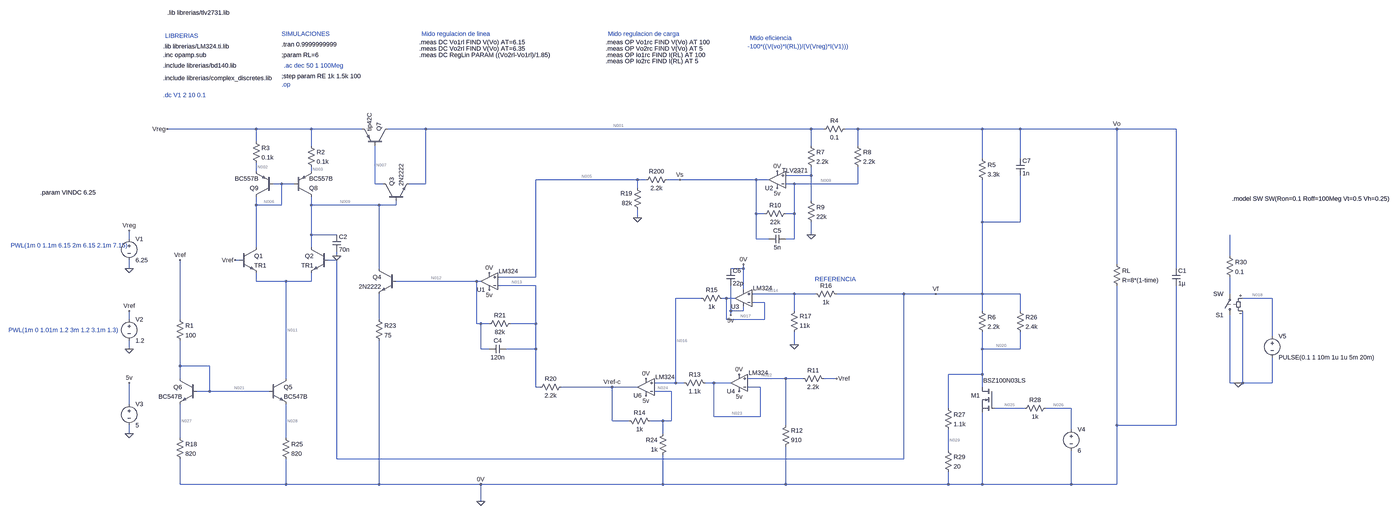
[diagram p0: schematic reguladorB_analisis_termico.asc, whole sheet]
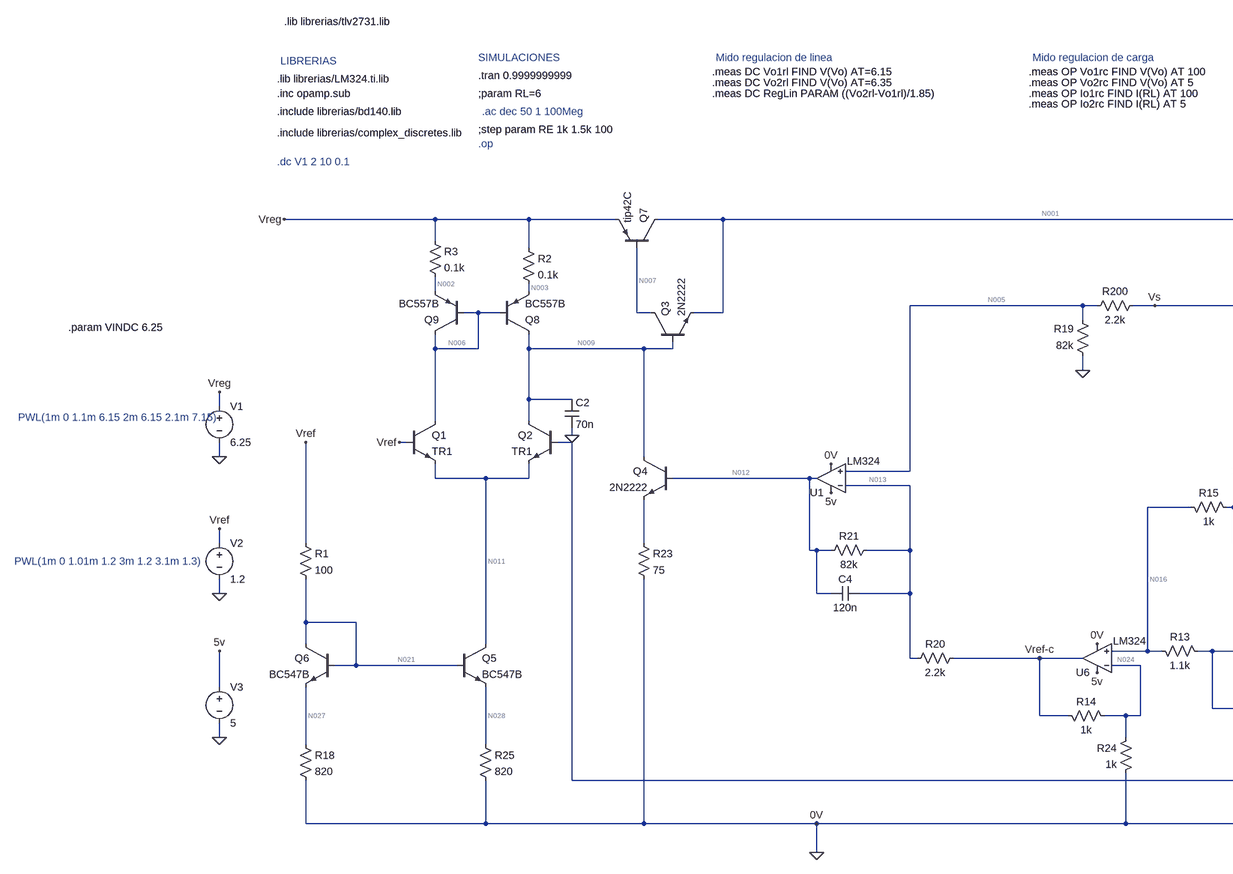
[diagram p1: schematic reguladorB_analisis_termico.asc, part, row 1 of 1, column 1 of 2]
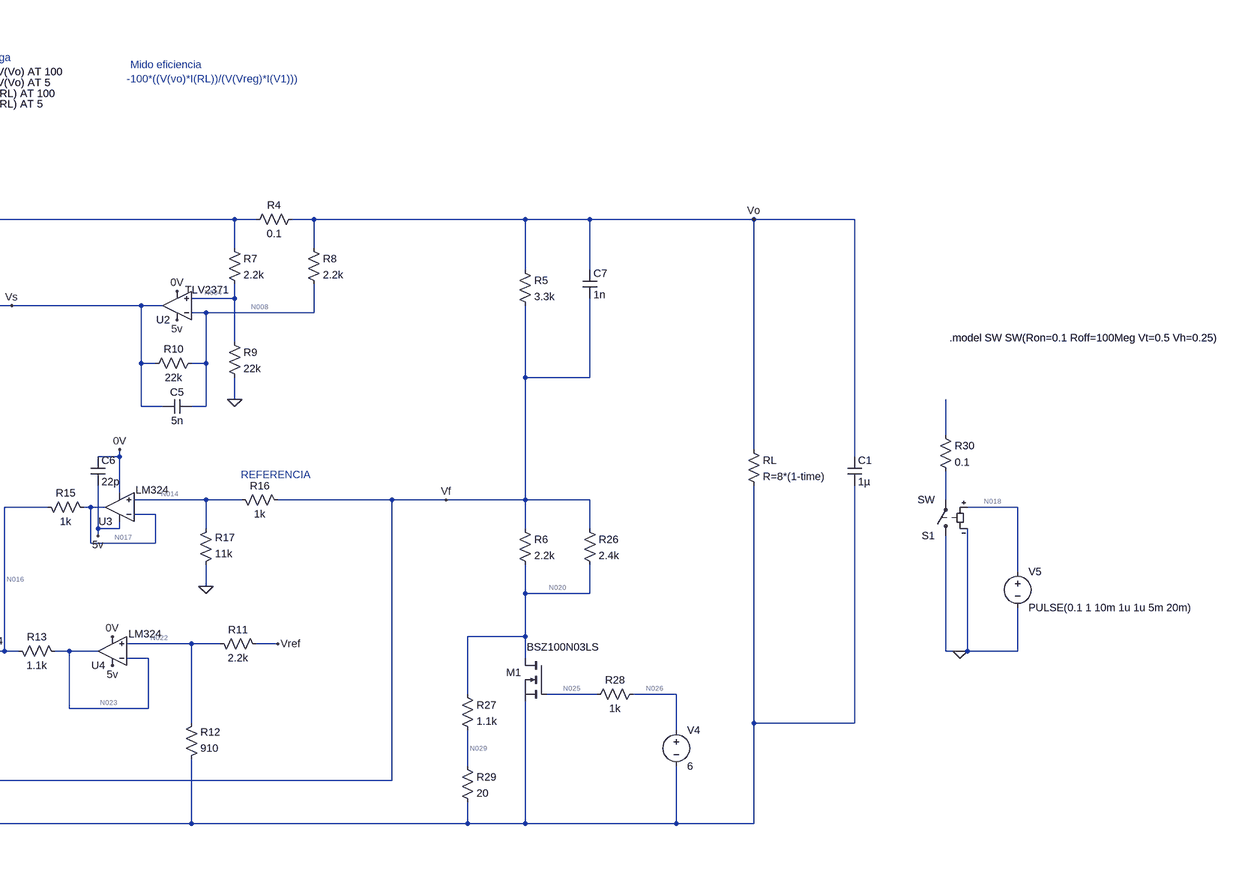
[diagram p2: schematic reguladorB_analisis_termico.asc, part, row 1 of 1, column 2 of 2]
reguladorB_analisis_termico.asc, the LTspice schematic file:
Version 4
SHEET 1 4852 1556
WIRE 128 -336 -208 -336
WIRE 336 -336 128 -336
WIRE 528 -336 336 -336
WIRE 768 -336 624 -336
WIRE 2224 -336 768 -336
WIRE 2272 -336 2224 -336
WIRE 2400 -336 2352 -336
WIRE 3040 -336 2400 -336
WIRE 3184 -336 3040 -336
WIRE 3632 -336 3184 -336
WIRE 3856 -336 3632 -336
WIRE 128 -288 128 -336
WIRE 336 -272 336 -336
WIRE 2224 -272 2224 -336
WIRE 2400 -272 2400 -336
WIRE 3040 -224 3040 -336
WIRE 3184 -224 3184 -336
WIRE 128 -176 128 -208
WIRE 336 -176 336 -192
WIRE 2224 -160 2224 -192
WIRE 2224 -160 2128 -160
WIRE 1568 -144 1184 -144
WIRE 1600 -144 1568 -144
WIRE 1728 -144 1680 -144
WIRE 2016 -144 1728 -144
WIRE 2064 -144 2016 -144
WIRE 224 -128 192 -128
WIRE 272 -128 224 -128
WIRE 576 -128 576 -272
WIRE 608 -128 576 -128
WIRE 768 -128 768 -336
WIRE 768 -128 704 -128
WIRE 2160 -128 2128 -128
WIRE 2400 -128 2400 -192
WIRE 2400 -128 2160 -128
WIRE 1568 -112 1568 -144
WIRE 2224 -64 2224 -160
WIRE 128 -48 128 -80
WIRE 224 -48 224 -128
WIRE 224 -48 128 -48
WIRE 336 -48 336 -80
WIRE 592 -48 336 -48
WIRE 656 -48 656 -64
WIRE 656 -48 592 -48
WIRE 2016 -16 2016 -144
WIRE 2048 -16 2016 -16
WIRE 2160 -16 2160 -128
WIRE 2160 -16 2128 -16
WIRE 1568 0 1568 -32
WIRE 3040 16 3040 -144
WIRE 3184 16 3184 -160
WIRE 3184 16 3040 16
WIRE 336 64 336 -48
WIRE 432 64 336 64
WIRE 2224 64 2224 16
WIRE -352 80 -352 48
WIRE 2016 80 2016 -16
WIRE 2064 80 2016 80
WIRE 2160 80 2160 -16
WIRE 2160 80 2128 80
WIRE 128 112 128 -48
WIRE 336 112 336 64
WIRE 432 144 432 128
WIRE 4192 144 4192 64
WIRE 64 160 48 160
WIRE 432 160 400 160
WIRE 3632 176 3632 -336
WIRE -352 192 -352 160
WIRE 592 192 592 -48
WIRE 1968 192 1968 176
WIRE 1968 192 1920 192
WIRE 3856 192 3856 -336
WIRE 1184 224 1184 -144
WIRE 1184 224 1040 224
WIRE 128 240 128 208
WIRE 240 240 128 240
WIRE 336 240 336 208
WIRE 336 240 240 240
WIRE 960 240 656 240
WIRE 976 240 960 240
WIRE 1184 256 1040 256
WIRE 1968 272 1968 192
WIRE 2160 288 2000 288
WIRE 2240 288 2160 288
WIRE 2640 288 2320 288
WIRE 2864 288 2640 288
WIRE 3040 288 3040 16
WIRE 3040 288 2864 288
WIRE 3184 288 3040 288
WIRE 4192 288 4192 224
WIRE 1808 304 1712 304
WIRE 1904 304 1888 304
WIRE 1936 304 1904 304
WIRE 4352 304 4240 304
WIRE 2048 320 2000 320
WIRE 1920 352 1920 256
WIRE 1968 352 1968 336
WIRE 1968 352 1920 352
WIRE 2160 352 2160 288
WIRE 3040 352 3040 288
WIRE 3184 352 3184 288
WIRE 1920 368 1920 352
WIRE -352 384 -352 352
WIRE -160 384 -160 160
WIRE 592 384 592 288
WIRE 1904 384 1904 304
WIRE 2048 384 2048 320
WIRE 2048 384 1904 384
WIRE 960 400 960 240
WIRE 976 400 960 400
WIRE 1008 400 976 400
WIRE 1184 400 1184 256
WIRE 1184 400 1088 400
WIRE 4352 448 4352 304
WIRE 2160 480 2160 432
WIRE -352 496 -352 464
WIRE 976 496 976 400
WIRE 1008 496 976 496
WIRE 1184 496 1184 400
WIRE 1184 496 1072 496
WIRE 3040 496 3040 432
WIRE 3184 496 3184 432
WIRE 3184 496 3040 496
WIRE -160 560 -160 464
WIRE -48 560 -160 560
WIRE 3040 592 3040 496
WIRE 3040 592 2912 592
WIRE -160 608 -160 560
WIRE 240 608 240 240
WIRE 2128 608 1984 608
WIRE 2192 608 2128 608
WIRE 2320 608 2272 608
WIRE 1712 624 1712 304
WIRE 1712 624 1632 624
WIRE 1744 624 1712 624
WIRE 1856 624 1824 624
WIRE 1920 624 1856 624
WIRE 4192 624 4192 368
WIRE 4224 624 4192 624
WIRE 4240 624 4240 352
WIRE 4240 624 4224 624
WIRE 4352 624 4352 528
WIRE 4352 624 4240 624
WIRE 1184 640 1184 496
WIRE 1200 640 1184 640
WIRE 1472 640 1280 640
WIRE 1568 640 1472 640
WIRE 2032 640 1984 640
WIRE 3040 640 3040 592
WIRE -48 656 -48 560
WIRE -48 656 -96 656
WIRE 176 656 -48 656
WIRE 1696 656 1632 656
WIRE -352 704 -352 624
WIRE 2912 720 2912 592
WIRE 3200 720 3088 720
WIRE 3376 720 3280 720
WIRE 1856 752 1856 624
WIRE 2032 752 2032 640
WIRE 2032 752 1856 752
WIRE 1472 768 1472 640
WIRE 1536 768 1472 768
WIRE 1664 768 1616 768
WIRE 1696 768 1696 656
WIRE 1696 768 1664 768
WIRE 2128 784 2128 608
WIRE 3632 784 3632 256
WIRE 3856 784 3856 256
WIRE 3856 784 3632 784
WIRE 3376 800 3376 720
WIRE -352 816 -352 784
WIRE 1664 816 1664 768
WIRE -160 832 -160 704
WIRE 240 832 240 704
WIRE 2912 880 2912 800
WIRE 432 912 432 160
WIRE 2640 912 2640 288
WIRE 2640 912 432 912
WIRE -160 1008 -160 912
WIRE 240 1008 240 912
WIRE 240 1008 -160 1008
WIRE 592 1008 592 464
WIRE 592 1008 240 1008
WIRE 976 1008 592 1008
WIRE 1664 1008 1664 896
WIRE 1664 1008 976 1008
WIRE 2128 1008 2128 864
WIRE 2128 1008 1664 1008
WIRE 2912 1008 2912 960
WIRE 2912 1008 2128 1008
WIRE 3040 1008 3040 736
WIRE 3040 1008 2912 1008
WIRE 3376 1008 3376 880
WIRE 3376 1008 3040 1008
WIRE 3632 1008 3632 784
WIRE 3632 1008 3376 1008
WIRE 976 1072 976 1008
FLAG 976 1072 0
FLAG -352 192 0
FLAG -352 496 0
FLAG -352 48 Vreg
FLAG -208 -336 Vreg
FLAG -352 352 Vref
FLAG 48 160 Vref
FLAG 1728 -144 Vs
FLAG 2160 480 0
FLAG 1472 640 Vref-c
FLAG 1568 0 0
FLAG 2320 608 Vref
FLAG 2864 288 Vf
FLAG 2224 64 0
FLAG 976 1008 0V
FLAG 2096 -176 0V
FLAG 1008 208 0V
FLAG 1968 176 0V
FLAG 1952 592 0V
FLAG 1600 608 0V
FLAG -352 816 0
FLAG -352 624 5v
FLAG 1920 368 5v
FLAG 2096 -112 5v
FLAG 1952 656 5v
FLAG 1600 672 5v
FLAG 1008 272 5v
FLAG 3632 -336 Vo
FLAG -160 160 Vref
FLAG 4224 624 0
FLAG 432 144 0
DATAFLAG 48 160 ""
DATAFLAG 336 -16 ""
DATAFLAG 128 32 ""
DATAFLAG 3536 -336 ""
DATAFLAG 2128 -336 ""
DATAFLAG 1936 -144 ""
DATAFLAG 1184 160 ""
DATAFLAG 1184 304 ""
DATAFLAG 912 240 ""
DATAFLAG 2544 288 ""
DATAFLAG 2128 688 ""
DATAFLAG 1872 624 ""
DATAFLAG 1360 640 ""
SYMBOL npn 64 112 R0
SYMATTR InstName Q1
SYMATTR Value TR1
SYMBOL npn 400 112 M0
SYMATTR InstName Q2
SYMATTR Value TR1
SYMBOL npn 608 -64 R270
SYMATTR InstName Q3
SYMATTR Value 2N2222
SYMBOL npn 176 608 R0
SYMATTR InstName Q5
SYMATTR Value BC547B
SYMBOL npn -96 608 M0
SYMATTR InstName Q6
SYMATTR Value BC547B
SYMBOL res -176 368 R0
SYMATTR InstName R1
SYMATTR Value 100
SYMBOL res 320 -288 R0
SYMATTR InstName R2
SYMATTR Value 0.1k
SYMBOL res 112 -304 R0
SYMATTR InstName R3
SYMATTR Value 0.1k
SYMBOL res 3616 160 R0
SYMATTR InstName RL
SYMATTR Value R=8*(1-time)
SYMBOL pnp 624 -272 M270
SYMATTR InstName Q7
SYMATTR Value tip42C
SYMBOL pnp 272 -80 M180
SYMATTR InstName Q8
SYMATTR Value BC557B
SYMBOL pnp 192 -80 R180
SYMATTR InstName Q9
SYMATTR Value BC557B
SYMBOL voltage -352 64 R0
WINDOW 123 0 0 Left 0
WINDOW 39 0 0 Left 0
SYMATTR InstName V1
SYMATTR Value 6.25
SYMBOL voltage -352 368 R0
WINDOW 123 0 0 Left 0
WINDOW 39 0 0 Left 0
SYMATTR InstName V2
SYMATTR Value 1.2
SYMBOL res 2208 -288 R0
SYMATTR InstName R7
SYMATTR Value 2.2k
SYMBOL res 2384 -288 R0
SYMATTR InstName R8
SYMATTR Value 2.2k
SYMBOL res 2208 -80 R0
SYMATTR InstName R9
SYMATTR Value 22k
SYMBOL res 2144 -32 R90
WINDOW 0 0 56 VBottom 2
WINDOW 3 32 56 VTop 2
SYMATTR InstName R10
SYMATTR Value 22k
SYMBOL res 2176 592 M90
WINDOW 0 0 56 VBottom 2
WINDOW 3 32 56 VTop 2
SYMATTR InstName R11
SYMATTR Value 2.2k
SYMBOL res 2112 880 M180
WINDOW 0 36 76 Left 2
WINDOW 3 36 40 Left 2
SYMATTR InstName R12
SYMATTR Value 910
SYMBOL res 1728 608 M90
WINDOW 0 0 56 VBottom 2
WINDOW 3 32 56 VTop 2
SYMATTR InstName R13
SYMATTR Value 1.1k
SYMBOL res 1520 752 M90
WINDOW 0 0 56 VBottom 2
WINDOW 3 32 56 VTop 2
SYMATTR InstName R14
SYMATTR Value 1k
SYMBOL res 1792 288 M90
WINDOW 0 0 56 VBottom 2
WINDOW 3 32 56 VTop 2
SYMATTR InstName R15
SYMATTR Value 1k
SYMBOL res 2224 272 M90
WINDOW 0 0 56 VBottom 2
WINDOW 3 32 56 VTop 2
SYMATTR InstName R16
SYMATTR Value 1k
SYMBOL res 2144 448 M180
WINDOW 0 36 76 Left 2
WINDOW 3 36 40 Left 2
SYMATTR InstName R17
SYMATTR Value 11k
SYMBOL res 1184 656 R270
WINDOW 0 32 56 VTop 2
WINDOW 3 0 56 VBottom 2
SYMATTR InstName R20
SYMATTR Value 2.2k
SYMBOL res 576 368 R0
SYMATTR InstName R23
SYMATTR Value 75
SYMBOL res 1680 800 M0
SYMATTR InstName R24
SYMATTR Value 1k
SYMBOL res 992 416 R270
WINDOW 0 32 56 VTop 2
WINDOW 3 0 56 VBottom 2
SYMATTR InstName R21
SYMATTR Value 82k
SYMBOL res 1696 -160 R90
WINDOW 0 0 56 VBottom 2
WINDOW 3 32 56 VTop 2
SYMATTR InstName R200
SYMATTR Value 2.2k
SYMBOL res 1584 -16 R180
WINDOW 0 36 76 Left 2
WINDOW 3 36 40 Left 2
SYMATTR InstName R19
SYMATTR Value 82k
SYMBOL res 2256 -320 R270
WINDOW 0 32 56 VTop 2
WINDOW 3 0 56 VBottom 2
SYMATTR InstName R4
SYMATTR Value 0.1
SYMBOL npn 656 192 M0
SYMATTR InstName Q4
SYMATTR Value 2N2222
SYMBOL OpAmps\\opamp2 1600 704 R180
WINDOW 3 -110 102 Left 2
SYMATTR Value LM324
SYMATTR InstName U6
SYMBOL OpAmps\\opamp2 2096 -80 R180
WINDOW 3 -116 99 Left 2
SYMATTR Value TLV2371
SYMATTR InstName U2
SYMBOL OpAmps\\opamp2 1008 304 R180
WINDOW 3 -110 102 Left 2
SYMATTR Value LM324
SYMATTR InstName U1
SYMBOL OpAmps\\opamp2 1968 368 R180
WINDOW 3 -110 102 Left 2
SYMATTR Value LM324
SYMATTR InstName U3
SYMBOL OpAmps\\opamp2 1952 688 R180
WINDOW 3 -110 102 Left 2
SYMATTR Value LM324
SYMATTR InstName U4
SYMBOL voltage -352 688 R0
WINDOW 123 0 0 Left 0
WINDOW 39 0 0 Left 0
SYMATTR InstName V3
SYMATTR Value 5
SYMBOL res 3024 -240 R0
SYMATTR InstName R5
SYMATTR Value 3.3k
SYMBOL res 3024 336 R0
SYMATTR InstName R6
SYMATTR Value 2.2k
SYMBOL res 3168 336 R0
SYMATTR InstName R26
SYMATTR Value 2.4k
SYMBOL nmos 3088 640 M0
WINDOW 3 -116 -25 Left 2
SYMATTR Value BSZ100N03LS
SYMATTR InstName M1
SYMBOL res 3296 704 R90
WINDOW 0 0 56 VBottom 2
WINDOW 3 32 56 VTop 2
SYMATTR InstName R28
SYMATTR Value 1k
SYMBOL voltage 3376 784 R0
WINDOW 123 0 0 Left 0
WINDOW 39 0 0 Left 0
SYMATTR InstName V4
SYMATTR Value 6
SYMBOL res 2896 704 R0
SYMATTR InstName R27
SYMATTR Value 1.1k
SYMBOL res 2896 864 R0
SYMATTR InstName R29
SYMATTR Value 20
SYMBOL res -176 816 R0
SYMATTR InstName R18
SYMATTR Value 820
SYMBOL res 224 816 R0
SYMATTR InstName R25
SYMATTR Value 820
SYMBOL voltage 4352 432 R0
WINDOW 123 0 0 Left 0
WINDOW 39 0 0 Left 0
SYMATTR InstName V5
SYMATTR Value PULSE(0.1 1 10m 1u 1u 5m 20m)
SYMBOL sw 4192 384 R180
SYMATTR InstName S1
SYMBOL res 4176 128 R0
SYMATTR InstName R30
SYMATTR Value 0.1
SYMBOL cap 416 64 R0
SYMATTR InstName C2
SYMATTR Value 70n
SYMBOL cap 3840 192 R0
SYMATTR InstName C1
SYMATTR Value 1µ
SYMBOL cap 1072 480 R90
WINDOW 0 0 32 VBottom 2
WINDOW 3 32 32 VTop 2
SYMATTR InstName C4
SYMATTR Value 120n
SYMBOL cap 2128 64 R90
WINDOW 0 0 32 VBottom 2
WINDOW 3 32 32 VTop 2
SYMATTR InstName C5
SYMATTR Value 5n
SYMBOL cap 1904 192 R0
SYMATTR InstName C6
SYMATTR Value 22p
SYMBOL cap 3168 -224 R0
SYMATTR InstName C7
SYMATTR Value 1n
TEXT 224 -536 Left 2 !;step param RE 1k 1.5k 100
TEXT 224 -616 Left 2 !;param RL=6
TEXT 224 -656 Left 2 !.tran 0.9999999999
TEXT -224 -576 Left 2 !.include librerias/bd140.lib
TEXT -224 -528 Left 2 !.include librerias/complex_discretes.lib
TEXT 224 -504 Left 2 ;.op
TEXT 2392 232 Right 2 ;REFERENCIA
TEXT -224 -616 Left 2 !.inc opamp.sub
TEXT -224 -648 Left 2 !.lib librerias/LM324.ti.lib
TEXT -216 -688 Left 2 ;LIBRERIAS
TEXT 224 -696 Left 2 ;SIMULACIONES
TEXT 744 -664 Left 2 !.meas DC Vo1rl FIND V(Vo) AT=6.15
TEXT 744 -640 Left 2 !.meas DC Vo2rl FIND V(Vo) AT=6.35
TEXT 744 -616 Left 2 !.meas DC RegLin PARAM ((Vo2rl-Vo1rl)/1.85)
TEXT 752 -696 Left 2 ;Mido regulacion de linea
TEXT 1448 -664 Left 2 !.meas OP Vo1rc FIND V(Vo) AT 100
TEXT 1448 -640 Left 2 !.meas OP Vo2rc FIND V(Vo) AT 5
TEXT 1448 -616 Left 2 !.meas OP Io1rc FIND I(RL) AT 100
TEXT 1448 -592 Left 2 !.meas OP Io2rc FIND I(RL) AT 5
TEXT 1456 -696 Left 2 ;Mido regulacion de carga
TEXT 1984 -648 Left 2 ;-100*((V(vo)*I(RL))/(V(Vreg)*I(V1)))
TEXT 1992 -680 Left 2 ;Mido eficiencia
TEXT -224 -464 Left 2 ;.dc V1 2 10 0.1
TEXT -688 -96 Left 2 !.param VINDC 6.25
TEXT -208 -776 Left 2 !.lib librerias/tlv2731.lib
TEXT 4200 -72 Left 2 !.model SW SW(Ron=0.1 Roff=100Meg Vt=0.5 Vh=0.25)
TEXT 232 -576 Left 2 ;.ac dec 50 1 100Meg
TEXT -808 424 Left 2 ;PWL(1m 0 1.01m 1.2 3m 1.2 3.1m 1.3)
TEXT -800 104 Left 2 ;PWL(1m 0 1.1m 6.15 2m 6.15 2.1m 7.15)

The netlist it stands for:
* reguladorB_analisis_termico.asc
Q1 N006 Vref N011 0 TR1
Q2 N009 Vf N011 0 TR1
Q3 N007 N009 N001 0 2N2222
Q5 N011 N021 N028 0 BC547B
Q6 N021 N021 N027 0 BC547B
R1 Vref N021 100
R2 Vreg N003 0.1k
R3 Vreg N002 0.1k
RL Vo 0 R=8*(1-time)
Q7 N001 N007 Vreg 0 tip42C
Q8 N009 N006 N003 0 BC557B
Q9 N006 N006 N002 0 BC557B
V1 Vreg 0 6.25
V2 Vref 0 1.2
R7 N001 N004 2.2k
R8 Vo N008 2.2k
R9 N004 0 22k
R10 N008 Vs 22k
R11 N022 Vref 2.2k
R12 0 N022 910
R13 N016 N023 1.1k
R14 Vref-c N024 1k
R15 N016 N017 1k
R16 N014 Vf 1k
R17 0 N014 11k
R20 N013 Vref-c 2.2k
R23 N019 0 75
R24 N024 0 1k
R21 N012 N013 82k
R200 Vs N005 2.2k
R19 0 N005 82k
R4 N001 Vo 0.1
Q4 N009 N012 N019 0 2N2222
XU6 N016 N024 5v 0 Vref-c LM324  ; pins In+ In- V+ V- OUT
XU2 N004 N008 5v 0 Vs TLV2371  ; pins In+ In- V+ V- OUT
XU1 N005 N013 5v 0 N012 LM324  ; pins In+ In- V+ V- OUT
XU3 N014 N017 5v 0 N017 LM324  ; pins In+ In- V+ V- OUT
XU4 N022 N023 5v 0 N023 LM324  ; pins In+ In- V+ V- OUT
V3 5v 0 5
R5 Vo Vf 3.3k
R6 Vf N020 2.2k
R26 Vf N020 2.4k
M1 N020 N025 0 0 BSZ100N03LS
R28 N026 N025 1k
V4 N026 0 6
R27 N020 N029 1.1k
R29 N029 0 20
R18 N027 0 820
R25 N028 0 820
V5 N018 0 PULSE(0.1 1 10m 1u 1u 5m 20m)
S1 0 N015 N018 0 SW
R30 N010 N015 0.1
C2 N009 0 70n
C1 Vo 0 1µ
C4 N013 N012 120n
C5 N008 Vs 5n
C6 0 5v 22p
C7 Vo Vf 1n
.model NPN NPN
.model PNP PNP
.lib standard.bjt
.model NMOS NMOS
.model PMOS PMOS
.lib standard.mos
;step param RE 1k 1.5k 100
;param RL=6
.tran 0.9999999999
.include librerias/bd140.lib
.include librerias/complex_discretes.lib
* .op
* REFERENCIA
.inc opamp.sub
.lib librerias/LM324.ti.lib
* LIBRERIAS
* SIMULACIONES
.meas DC Vo1rl FIND V(Vo) AT=6.15
.meas DC Vo2rl FIND V(Vo) AT=6.35
.meas DC RegLin PARAM ((Vo2rl-Vo1rl)/1.85)
* Mido regulacion de linea
.meas OP Vo1rc FIND V(Vo) AT 100
.meas OP Vo2rc FIND V(Vo) AT 5
.meas OP Io1rc FIND I(RL) AT 100
.meas OP Io2rc FIND I(RL) AT 5
* Mido regulacion de carga
* -100*((V(vo)*I(RL))/(V(Vreg)*I(V1)))
* Mido eficiencia
* .dc V1 2 10 0.1
.param VINDC 6.25
.lib librerias/tlv2731.lib
.model SW SW(Ron=0.1 Roff=100Meg Vt=0.5 Vh=0.25)
* .ac dec 50 1 100Meg
* PWL(1m 0 1.01m 1.2 3m 1.2 3.1m 1.3)
* PWL(1m 0 1.1m 6.15 2m 6.15 2.1m 7.15)
.backanno
.end

* Results of the author's LTspice run, read from the files saved beside the schematic
* Operating Point, zero values left out:
*   V(n006) = 5.621 V
*   V(vref) = 1.2 V
*   V(n011) = 593.8 mV
*   V(n009) = 5.739 V
*   V(vf) = 1.197 V
*   V(n007) = 5.467 V
*   V(n001) = 5.031 V
*   V(n021) = 1.137 V
*   V(n028) = 509.4 mV
*   V(n027) = 510.7 mV
*   V(vreg) = 6.25 V
*   V(n003) = 6.218 V
*   V(n002) = 6.218 V
*   V(vo) = 4.969 V
*   V(n004) = 4.573 V
*   V(n008) = 4.575 V
*   V(vs) = 637.9 mV
*   V(n022) = 351.1 mV
*   V(n016) = 741.9 mV
*   V(n023) = 351.2 mV
*   V(vref-c) = 1.484 V
*   V(n024) = 741.9 mV
*   V(n017) = 1.097 V
*   V(n014) = 1.097 V
*   V(n013) = 1.445 V
*   V(n012) = 4.448 mV
*   V(n005) = 621.3 mV
*   V(5v) = 5 V
*   V(n020) = 9.535 µV
*   V(n025) = 6 V
*   V(n026) = 6 V
*   V(n029) = 170.3 nV
*   V(n018) = 100 mV
*   I(Rl) = 621.1 mA
*   Ic(Q1) = 325.8 µA
*   Ib(Q1) = 992.8 nA
*   Ie(Q1) = -326.8 µA
*   Ic(Q2) = 286.1 µA
*   Ib(Q2) = 870.3 nA
*   Ie(Q2) = -287 µA
*   Ic(Q3) = 7.179 mA
*   Ib(Q3) = 36.86 µA
*   Ie(Q3) = -7.215 mA
*   Ic(Q4) = 5.749 pA
*   Ib(Q4) = -5.734 pA
*   Ic(Q5) = 613.8 µA
*   Ib(Q5) = 7.425 µA
*   Ie(Q5) = -621.2 µA
*   Ic(Q6) = 620.6 µA
*   Ib(Q6) = 2.195 µA
*   Ie(Q6) = -622.8 µA
*   Ic(Q7) = -615.4 mA
*   Ib(Q7) = -7.179 mA
*   Ie(Q7) = 622.6 mA
*   Ic(Q8) = -323 µA
*   Ib(Q8) = -1.009 µA
*   Ie(Q8) = 324 µA
*   Ic(Q9) = -323.8 µA
*   Ib(Q9) = -1.006 µA
*   Ie(Q9) = 324.8 µA
*   Id(M1) = 1.042 mA
*   Is(M1) = -1.042 mA
*   I(R1) = 630.2 µA
*   I(R2) = 324 µA
*   I(R3) = 324.8 µA
*   I(R7) = 207.9 µA
*   I(R8) = 179 µA
*   I(R9) = 207.9 µA
*   I(R10) = 179 µA
*   I(R11) = -385.8 µA
*   I(R12) = -385.9 µA
*   I(R13) = 355.1 µA
*   I(R14) = 741.9 µA
*   I(R15) = -355.1 µA
*   I(R16) = -99.7 µA
*   I(R17) = -99.72 µA
*   I(R20) = -17.57 µA
*   I(R24) = 741.9 µA
*   I(R21) = -17.57 µA
*   I(R200) = 7.537 µA
*   I(R19) = -7.577 µA
*   I(R4) = 622.4 mA
*   I(R5) = 1.143 mA
*   I(R6) = 543.9 µA
*   I(R26) = 498.6 µA
*   I(R27) = 8.513 nA
*   I(R29) = 8.513 nA
*   I(R18) = 622.8 µA
*   I(R25) = 621.2 µA
*   I(V1) = -623.2 mA
*   I(V2) = -1.017 mA
*   I(V3) = -1.207 mA
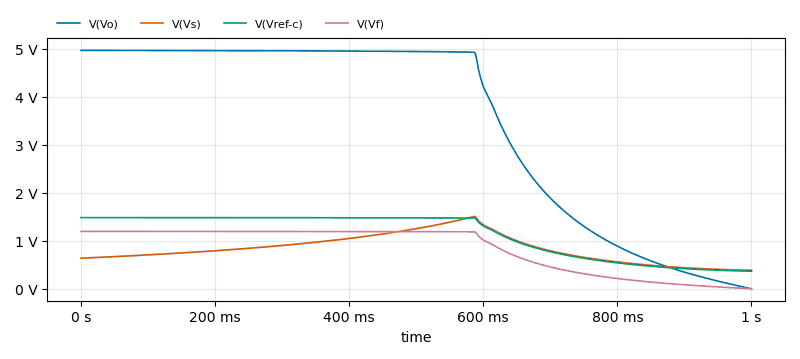
[diagram p3: Transient Analysis of reguladorB_analisis_termico.asc, plotted from the saved traces]
* Transient Analysis, 1 run:
*   V(Vo): min 0 V, max 4.969 V, average 3.467 V, rms 3.975 V, last 0 V
*   V(Vs): min 385 mV, max 1.507 V, average 834.3 mV, rms 884 mV, last 385 mV
*   V(Vref-c): min 366.5 mV, max 1.484 V, average 1.138 V, rms 1.223 V, last 366.5 mV
*   V(Vf): min 18.3 µV, max 1.197 V, average 835.1 mV, rms 957.5 mV, last 18.3 µV